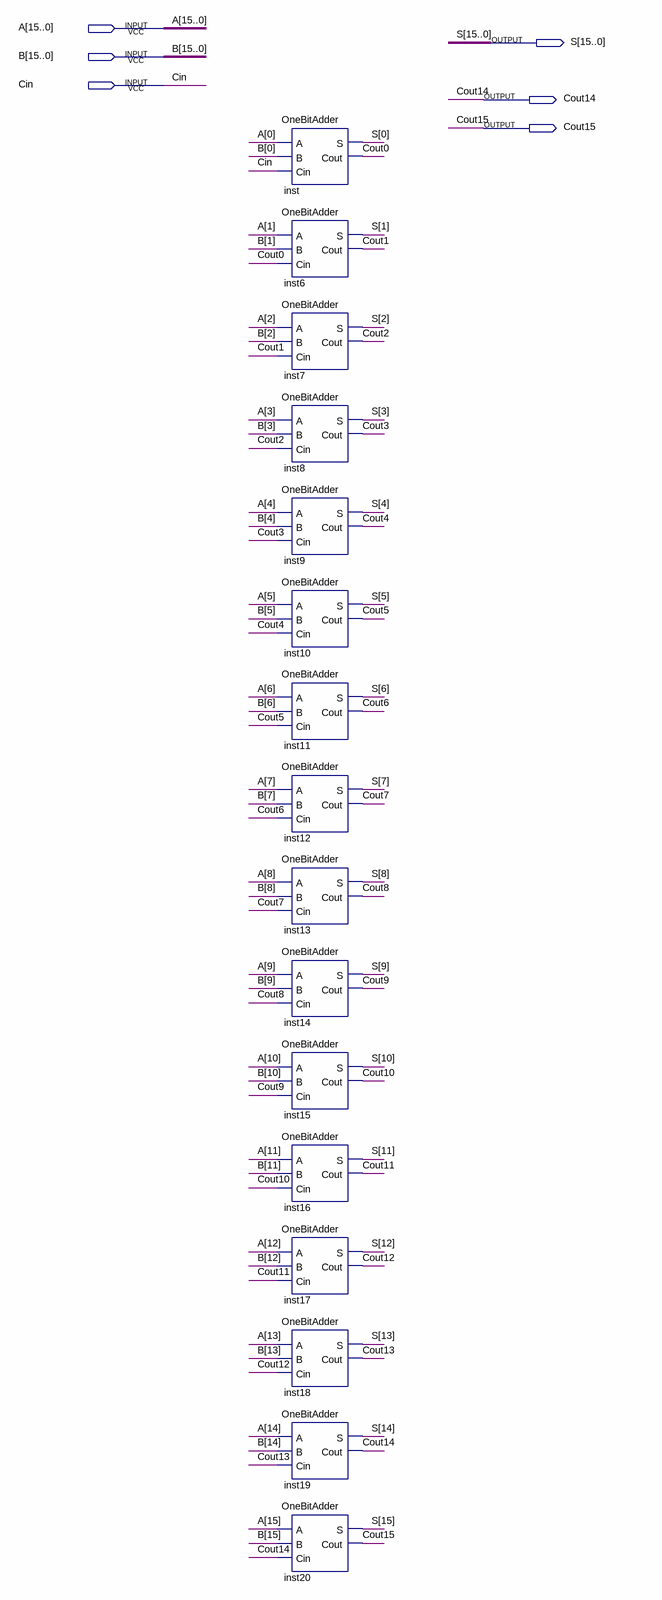
[diagram p0: schematic sheet]
// Quartus schematic SixteenBitRealAdder.bdf as structural Verilog: 16 symbols, 6 pins
module SixteenBitRealAdder (
  input  [15:0] A,
  input  [15:0] B,
  input  Cin,
  output [15:0] S,
  output Cout14,
  output Cout15
);

  wire Cout0, Cout1, Cout2, Cout3, Cout4, Cout5, Cout6, Cout7, Cout8, Cout9, Cout10, Cout11, Cout12, Cout13;

  OneBitAdder inst (.A(A[0]), .B(B[0]), .Cin(Cin), .S(S[0]), .Cout(Cout0));
  OneBitAdder inst6 (.A(A[1]), .B(B[1]), .Cin(Cout0), .S(S[1]), .Cout(Cout1));
  OneBitAdder inst7 (.A(A[2]), .B(B[2]), .Cin(Cout1), .S(S[2]), .Cout(Cout2));
  OneBitAdder inst8 (.A(A[3]), .B(B[3]), .Cin(Cout2), .S(S[3]), .Cout(Cout3));
  OneBitAdder inst9 (.A(A[4]), .B(B[4]), .Cin(Cout3), .S(S[4]), .Cout(Cout4));
  OneBitAdder inst10 (.A(A[5]), .B(B[5]), .Cin(Cout4), .S(S[5]), .Cout(Cout5));
  OneBitAdder inst11 (.A(A[6]), .B(B[6]), .Cin(Cout5), .S(S[6]), .Cout(Cout6));
  OneBitAdder inst12 (.A(A[7]), .B(B[7]), .Cin(Cout6), .S(S[7]), .Cout(Cout7));
  OneBitAdder inst13 (.A(A[8]), .B(B[8]), .Cin(Cout7), .S(S[8]), .Cout(Cout8));
  OneBitAdder inst14 (.A(A[9]), .B(B[9]), .Cin(Cout8), .S(S[9]), .Cout(Cout9));
  OneBitAdder inst15 (.A(A[10]), .B(B[10]), .Cin(Cout9), .S(S[10]), .Cout(Cout10));
  OneBitAdder inst16 (.A(A[11]), .B(B[11]), .Cin(Cout10), .S(S[11]), .Cout(Cout11));
  OneBitAdder inst17 (.A(A[12]), .B(B[12]), .Cin(Cout11), .S(S[12]), .Cout(Cout12));
  OneBitAdder inst18 (.A(A[13]), .B(B[13]), .Cin(Cout12), .S(S[13]), .Cout(Cout13));
  OneBitAdder inst19 (.A(A[14]), .B(B[14]), .Cin(Cout13), .S(S[14]), .Cout(Cout14));
  OneBitAdder inst20 (.A(A[15]), .B(B[15]), .Cin(Cout14), .S(S[15]), .Cout(Cout15));
endmodule
